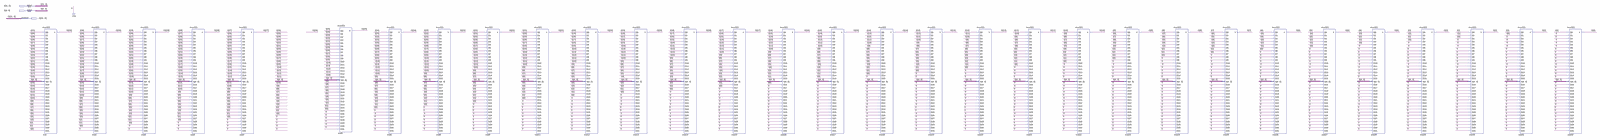
[diagram p0: schematic sheet, whole]
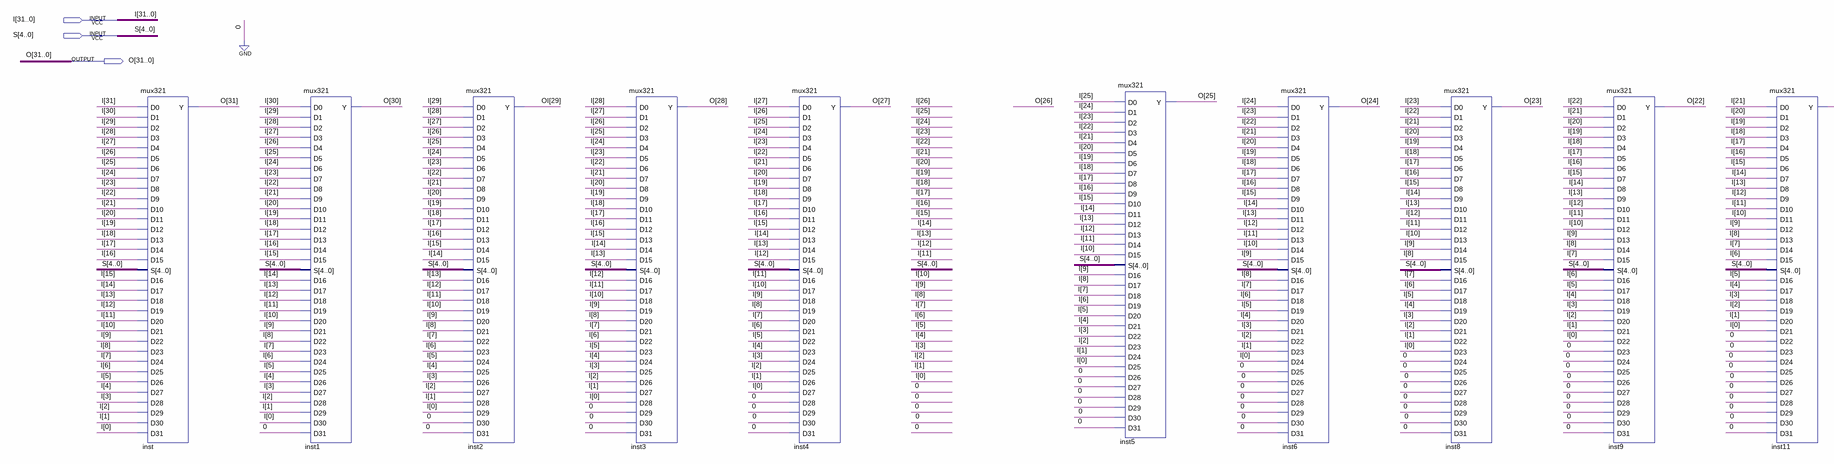
[diagram p1: schematic sheet, left part]
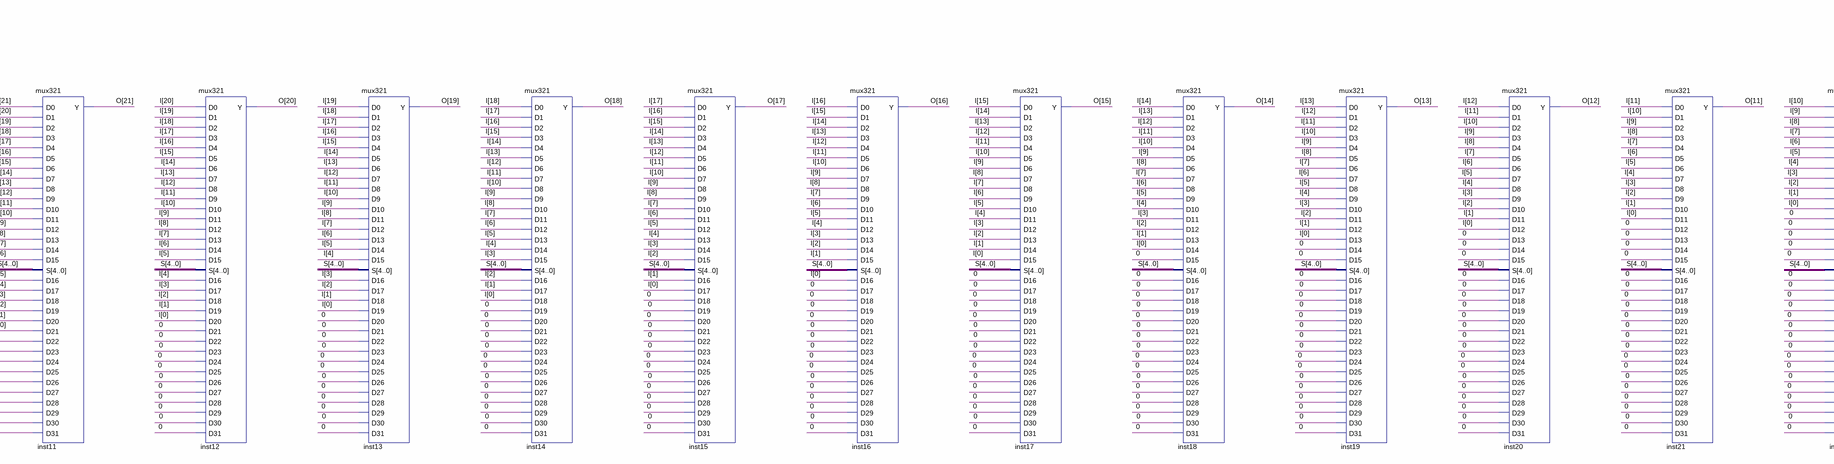
[diagram p2: schematic sheet, centre part]
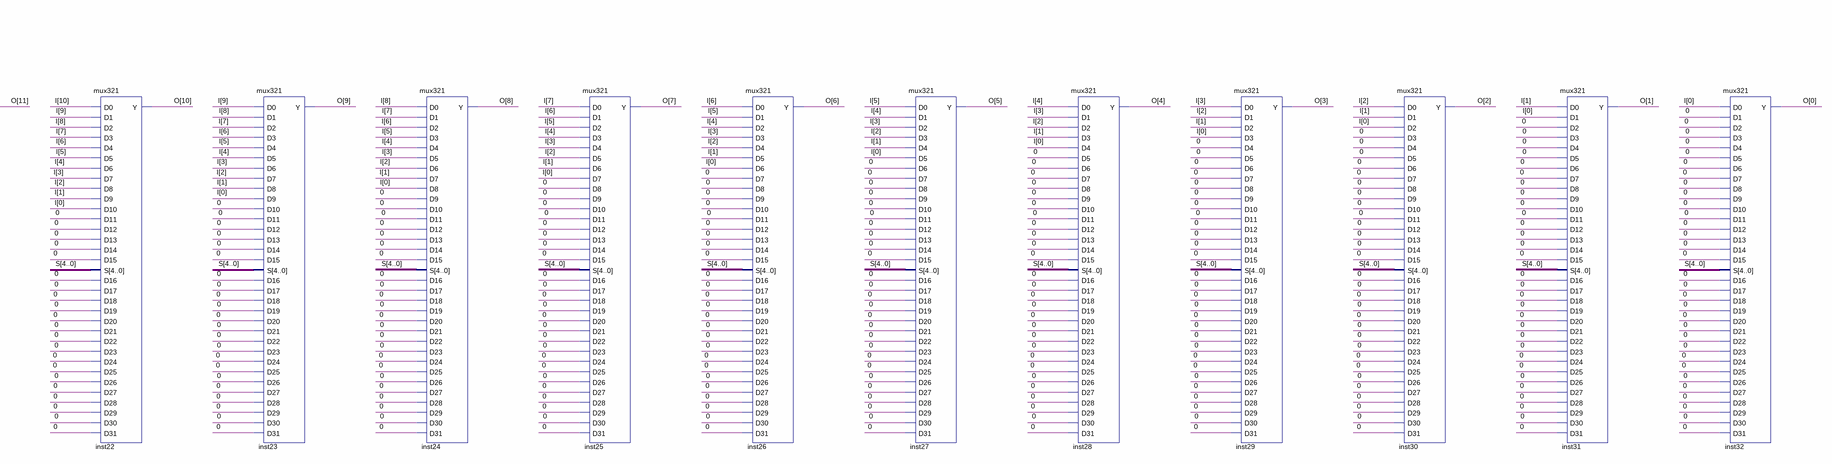
[diagram p3: schematic sheet, right part]
// Quartus schematic Shift_Left_32b.bdf as structural Verilog: 31 symbols, 3 pins
module Shift_Left_32b (
  input  [31:0] I,
  input  [4:0] S,
  output [31:0] O
);

  wire [29:29] OI;

  mux321 inst (
    .D0(I[31]), .D1(I[30]), .D2(I[29]), .D3(I[28]), .D4(I[27]), .D5(I[26]), .D6(I[25]), .D7(I[24]),
    .D8(I[23]), .D9(I[22]), .D10(I[21]), .D11(I[20]), .D12(I[19]), .D13(I[18]), .D14(I[17]), .D15(I[16]),
    .S(S), .D16(I[15]), .D17(I[14]), .D18(I[13]), .D19(I[12]), .D20(I[11]), .D21(I[10]), .D22(I[9]),
    .D23(I[8]), .D24(I[7]), .D25(I[6]), .D26(I[5]), .D27(I[4]), .D28(I[3]), .D29(I[2]), .D30(I[1]),
    .D31(I[0]), .Y(O[31]));
  mux321 inst1 (
    .D0(I[30]), .D1(I[29]), .D2(I[28]), .D3(I[27]), .D4(I[26]), .D5(I[25]), .D6(I[24]), .D7(I[23]),
    .D8(I[22]), .D9(I[21]), .D10(I[20]), .D11(I[19]), .D12(I[18]), .D13(I[17]), .D14(I[16]), .D15(I[15]),
    .S(S), .D16(I[14]), .D17(I[13]), .D18(I[12]), .D19(I[11]), .D20(I[10]), .D21(I[9]), .D22(I[8]),
    .D23(I[7]), .D24(I[6]), .D25(I[5]), .D26(I[4]), .D27(I[3]), .D28(I[2]), .D29(I[1]), .D30(I[0]),
    .D31(1'b0), .Y(O[30]));
  mux321 inst2 (
    .D0(I[29]), .D1(I[28]), .D2(I[27]), .D3(I[26]), .D4(I[25]), .D5(I[24]), .D6(I[23]), .D7(I[22]),
    .D8(I[21]), .D9(I[20]), .D10(I[19]), .D11(I[18]), .D12(I[17]), .D13(I[16]), .D14(I[15]), .D15(I[14]),
    .S(S), .D16(I[13]), .D17(I[12]), .D18(I[11]), .D19(I[10]), .D20(I[9]), .D21(I[8]), .D22(I[7]),
    .D23(I[6]), .D24(I[5]), .D25(I[4]), .D26(I[3]), .D27(I[2]), .D28(I[1]), .D29(I[0]), .D30(1'b0),
    .D31(1'b0), .Y(OI[29]));
  mux321 inst3 (
    .D0(I[28]), .D1(I[27]), .D2(I[26]), .D3(I[25]), .D4(I[24]), .D5(I[23]), .D6(I[22]), .D7(I[21]),
    .D8(I[20]), .D9(I[19]), .D10(I[18]), .D11(I[17]), .D12(I[16]), .D13(I[15]), .D14(I[14]), .D15(I[13]),
    .S(S), .D16(I[12]), .D17(I[11]), .D18(I[10]), .D19(I[9]), .D20(I[8]), .D21(I[7]), .D22(I[6]), .D23(I[5]),
    .D24(I[4]), .D25(I[3]), .D26(I[2]), .D27(I[1]), .D28(I[0]), .D29(1'b0), .D30(1'b0), .D31(1'b0), .Y(O[28]));
  mux321 inst4 (
    .D0(I[27]), .D1(I[26]), .D2(I[25]), .D3(I[24]), .D4(I[23]), .D5(I[22]), .D6(I[21]), .D7(I[20]),
    .D8(I[19]), .D9(I[18]), .D10(I[17]), .D11(I[16]), .D12(I[15]), .D13(I[14]), .D14(I[13]), .D15(I[12]),
    .S(S), .D16(I[11]), .D17(I[10]), .D18(I[9]), .D19(I[8]), .D20(I[7]), .D21(I[6]), .D22(I[5]), .D23(I[4]),
    .D24(I[3]), .D25(I[2]), .D26(I[1]), .D27(I[0]), .D28(1'b0), .D29(1'b0), .D30(1'b0), .D31(1'b0), .Y(O[27]));
  mux321 inst5 (
    .D0(I[25]), .D1(I[24]), .D2(I[23]), .D3(I[22]), .D4(I[21]), .D5(I[20]), .D6(I[19]), .D7(I[18]),
    .D8(I[17]), .D9(I[16]), .D10(I[15]), .D11(I[14]), .D12(I[13]), .D13(I[12]), .D14(I[11]), .D15(I[10]),
    .S(S), .D16(I[9]), .D17(I[8]), .D18(I[7]), .D19(I[6]), .D20(I[5]), .D21(I[4]), .D22(I[3]), .D23(I[2]),
    .D24(I[1]), .D25(I[0]), .D26(1'b0), .D27(1'b0), .D28(1'b0), .D29(1'b0), .D30(1'b0), .D31(1'b0), .Y(O[25]));
  mux321 inst6 (
    .D0(I[24]), .D1(I[23]), .D2(I[22]), .D3(I[21]), .D4(I[20]), .D5(I[19]), .D6(I[18]), .D7(I[17]),
    .D8(I[16]), .D9(I[15]), .D10(I[14]), .D11(I[13]), .D12(I[12]), .D13(I[11]), .D14(I[10]), .D15(I[9]),
    .S(S), .D16(I[8]), .D17(I[7]), .D18(I[6]), .D19(I[5]), .D20(I[4]), .D21(I[3]), .D22(I[2]), .D23(I[1]),
    .D24(I[0]), .D25(1'b0), .D26(1'b0), .D27(1'b0), .D28(1'b0), .D29(1'b0), .D30(1'b0), .D31(1'b0), .Y(O[24]));
  mux321 inst8 (
    .D0(I[23]), .D1(I[22]), .D2(I[21]), .D3(I[20]), .D4(I[19]), .D5(I[18]), .D6(I[17]), .D7(I[16]),
    .D8(I[15]), .D9(I[14]), .D10(I[13]), .D11(I[12]), .D12(I[11]), .D13(I[10]), .D14(I[9]), .D15(I[8]),
    .S(S), .D16(I[7]), .D17(I[6]), .D18(I[5]), .D19(I[4]), .D20(I[3]), .D21(I[2]), .D22(I[1]), .D23(I[0]),
    .D24(1'b0), .D25(1'b0), .D26(1'b0), .D27(1'b0), .D28(1'b0), .D29(1'b0), .D30(1'b0), .D31(1'b0), .Y(O[23]));
  mux321 inst9 (
    .D0(I[22]), .D1(I[21]), .D2(I[20]), .D3(I[19]), .D4(I[18]), .D5(I[17]), .D6(I[16]), .D7(I[15]),
    .D8(I[14]), .D9(I[13]), .D10(I[12]), .D11(I[11]), .D12(I[10]), .D13(I[9]), .D14(I[8]), .D15(I[7]), .S(S),
    .D16(I[6]), .D17(I[5]), .D18(I[4]), .D19(I[3]), .D20(I[2]), .D21(I[1]), .D22(I[0]), .D23(1'b0),
    .D24(1'b0), .D25(1'b0), .D26(1'b0), .D27(1'b0), .D28(1'b0), .D29(1'b0), .D30(1'b0), .D31(1'b0), .Y(O[22]));
  mux321 inst11 (
    .D0(I[21]), .D1(I[20]), .D2(I[19]), .D3(I[18]), .D4(I[17]), .D5(I[16]), .D6(I[15]), .D7(I[14]),
    .D8(I[13]), .D9(I[12]), .D10(I[11]), .D11(I[10]), .D12(I[9]), .D13(I[8]), .D14(I[7]), .D15(I[6]), .S(S),
    .D16(I[5]), .D17(I[4]), .D18(I[3]), .D19(I[2]), .D20(I[1]), .D21(I[0]), .D22(1'b0), .D23(1'b0),
    .D24(1'b0), .D25(1'b0), .D26(1'b0), .D27(1'b0), .D28(1'b0), .D29(1'b0), .D30(1'b0), .D31(1'b0), .Y(O[21]));
  mux321 inst12 (
    .D0(I[20]), .D1(I[19]), .D2(I[18]), .D3(I[17]), .D4(I[16]), .D5(I[15]), .D6(I[14]), .D7(I[13]),
    .D8(I[12]), .D9(I[11]), .D10(I[10]), .D11(I[9]), .D12(I[8]), .D13(I[7]), .D14(I[6]), .D15(I[5]), .S(S),
    .D16(I[4]), .D17(I[3]), .D18(I[2]), .D19(I[1]), .D20(I[0]), .D21(1'b0), .D22(1'b0), .D23(1'b0),
    .D24(1'b0), .D25(1'b0), .D26(1'b0), .D27(1'b0), .D28(1'b0), .D29(1'b0), .D30(1'b0), .D31(1'b0), .Y(O[20]));
  mux321 inst13 (
    .D0(I[19]), .D1(I[18]), .D2(I[17]), .D3(I[16]), .D4(I[15]), .D5(I[14]), .D6(I[13]), .D7(I[12]),
    .D8(I[11]), .D9(I[10]), .D10(I[9]), .D11(I[8]), .D12(I[7]), .D13(I[6]), .D14(I[5]), .D15(I[4]), .S(S),
    .D16(I[3]), .D17(I[2]), .D18(I[1]), .D19(I[0]), .D20(1'b0), .D21(1'b0), .D22(1'b0), .D23(1'b0),
    .D24(1'b0), .D25(1'b0), .D26(1'b0), .D27(1'b0), .D28(1'b0), .D29(1'b0), .D30(1'b0), .D31(1'b0), .Y(O[19]));
  mux321 inst14 (
    .D0(I[18]), .D1(I[17]), .D2(I[16]), .D3(I[15]), .D4(I[14]), .D5(I[13]), .D6(I[12]), .D7(I[11]),
    .D8(I[10]), .D9(I[9]), .D10(I[8]), .D11(I[7]), .D12(I[6]), .D13(I[5]), .D14(I[4]), .D15(I[3]), .S(S),
    .D16(I[2]), .D17(I[1]), .D18(I[0]), .D19(1'b0), .D20(1'b0), .D21(1'b0), .D22(1'b0), .D23(1'b0),
    .D24(1'b0), .D25(1'b0), .D26(1'b0), .D27(1'b0), .D28(1'b0), .D29(1'b0), .D30(1'b0), .D31(1'b0), .Y(O[18]));
  mux321 inst15 (
    .D0(I[17]), .D1(I[16]), .D2(I[15]), .D3(I[14]), .D4(I[13]), .D5(I[12]), .D6(I[11]), .D7(I[10]),
    .D8(I[9]), .D9(I[8]), .D10(I[7]), .D11(I[6]), .D12(I[5]), .D13(I[4]), .D14(I[3]), .D15(I[2]), .S(S),
    .D16(I[1]), .D17(I[0]), .D18(1'b0), .D19(1'b0), .D20(1'b0), .D21(1'b0), .D22(1'b0), .D23(1'b0),
    .D24(1'b0), .D25(1'b0), .D26(1'b0), .D27(1'b0), .D28(1'b0), .D29(1'b0), .D30(1'b0), .D31(1'b0), .Y(O[17]));
  mux321 inst16 (
    .D0(I[16]), .D1(I[15]), .D2(I[14]), .D3(I[13]), .D4(I[12]), .D5(I[11]), .D6(I[10]), .D7(I[9]), .D8(I[8]),
    .D9(I[7]), .D10(I[6]), .D11(I[5]), .D12(I[4]), .D13(I[3]), .D14(I[2]), .D15(I[1]), .S(S), .D16(I[0]),
    .D17(1'b0), .D18(1'b0), .D19(1'b0), .D20(1'b0), .D21(1'b0), .D22(1'b0), .D23(1'b0), .D24(1'b0),
    .D25(1'b0), .D26(1'b0), .D27(1'b0), .D28(1'b0), .D29(1'b0), .D30(1'b0), .D31(1'b0), .Y(O[16]));
  mux321 inst17 (
    .D0(I[15]), .D1(I[14]), .D2(I[13]), .D3(I[12]), .D4(I[11]), .D5(I[10]), .D6(I[9]), .D7(I[8]), .D8(I[7]),
    .D9(I[6]), .D10(I[5]), .D11(I[4]), .D12(I[3]), .D13(I[2]), .D14(I[1]), .D15(I[0]), .S(S), .D16(1'b0),
    .D17(1'b0), .D18(1'b0), .D19(1'b0), .D20(1'b0), .D21(1'b0), .D22(1'b0), .D23(1'b0), .D24(1'b0),
    .D25(1'b0), .D26(1'b0), .D27(1'b0), .D28(1'b0), .D29(1'b0), .D30(1'b0), .D31(1'b0), .Y(O[15]));
  mux321 inst18 (
    .D0(I[14]), .D1(I[13]), .D2(I[12]), .D3(I[11]), .D4(I[10]), .D5(I[9]), .D6(I[8]), .D7(I[7]), .D8(I[6]),
    .D9(I[5]), .D10(I[4]), .D11(I[3]), .D12(I[2]), .D13(I[1]), .D14(I[0]), .D15(1'b0), .S(S), .D16(1'b0),
    .D17(1'b0), .D18(1'b0), .D19(1'b0), .D20(1'b0), .D21(1'b0), .D22(1'b0), .D23(1'b0), .D24(1'b0),
    .D25(1'b0), .D26(1'b0), .D27(1'b0), .D28(1'b0), .D29(1'b0), .D30(1'b0), .D31(1'b0), .Y(O[14]));
  mux321 inst19 (
    .D0(I[13]), .D1(I[12]), .D2(I[11]), .D3(I[10]), .D4(I[9]), .D5(I[8]), .D6(I[7]), .D7(I[6]), .D8(I[5]),
    .D9(I[4]), .D10(I[3]), .D11(I[2]), .D12(I[1]), .D13(I[0]), .D14(1'b0), .D15(1'b0), .S(S), .D16(1'b0),
    .D17(1'b0), .D18(1'b0), .D19(1'b0), .D20(1'b0), .D21(1'b0), .D22(1'b0), .D23(1'b0), .D24(1'b0),
    .D25(1'b0), .D26(1'b0), .D27(1'b0), .D28(1'b0), .D29(1'b0), .D30(1'b0), .D31(1'b0), .Y(O[13]));
  mux321 inst20 (
    .D0(I[12]), .D1(I[11]), .D2(I[10]), .D3(I[9]), .D4(I[8]), .D5(I[7]), .D6(I[6]), .D7(I[5]), .D8(I[4]),
    .D9(I[3]), .D10(I[2]), .D11(I[1]), .D12(I[0]), .D13(1'b0), .D14(1'b0), .D15(1'b0), .S(S), .D16(1'b0),
    .D17(1'b0), .D18(1'b0), .D19(1'b0), .D20(1'b0), .D21(1'b0), .D22(1'b0), .D23(1'b0), .D24(1'b0),
    .D25(1'b0), .D26(1'b0), .D27(1'b0), .D28(1'b0), .D29(1'b0), .D30(1'b0), .D31(1'b0), .Y(O[12]));
  mux321 inst21 (
    .D0(I[11]), .D1(I[10]), .D2(I[9]), .D3(I[8]), .D4(I[7]), .D5(I[6]), .D6(I[5]), .D7(I[4]), .D8(I[3]),
    .D9(I[2]), .D10(I[1]), .D11(I[0]), .D12(1'b0), .D13(1'b0), .D14(1'b0), .D15(1'b0), .S(S), .D16(1'b0),
    .D17(1'b0), .D18(1'b0), .D19(1'b0), .D20(1'b0), .D21(1'b0), .D22(1'b0), .D23(1'b0), .D24(1'b0),
    .D25(1'b0), .D26(1'b0), .D27(1'b0), .D28(1'b0), .D29(1'b0), .D30(1'b0), .D31(1'b0), .Y(O[11]));
  mux321 inst22 (
    .D0(I[10]), .D1(I[9]), .D2(I[8]), .D3(I[7]), .D4(I[6]), .D5(I[5]), .D6(I[4]), .D7(I[3]), .D8(I[2]),
    .D9(I[1]), .D10(I[0]), .D11(1'b0), .D12(1'b0), .D13(1'b0), .D14(1'b0), .D15(1'b0), .S(S), .D16(1'b0),
    .D17(1'b0), .D18(1'b0), .D19(1'b0), .D20(1'b0), .D21(1'b0), .D22(1'b0), .D23(1'b0), .D24(1'b0),
    .D25(1'b0), .D26(1'b0), .D27(1'b0), .D28(1'b0), .D29(1'b0), .D30(1'b0), .D31(1'b0), .Y(O[10]));
  mux321 inst23 (
    .D0(I[9]), .D1(I[8]), .D2(I[7]), .D3(I[6]), .D4(I[5]), .D5(I[4]), .D6(I[3]), .D7(I[2]), .D8(I[1]),
    .D9(I[0]), .D10(1'b0), .D11(1'b0), .D12(1'b0), .D13(1'b0), .D14(1'b0), .D15(1'b0), .S(S), .D16(1'b0),
    .D17(1'b0), .D18(1'b0), .D19(1'b0), .D20(1'b0), .D21(1'b0), .D22(1'b0), .D23(1'b0), .D24(1'b0),
    .D25(1'b0), .D26(1'b0), .D27(1'b0), .D28(1'b0), .D29(1'b0), .D30(1'b0), .D31(1'b0), .Y(O[9]));
  mux321 inst24 (
    .D0(I[8]), .D1(I[7]), .D2(I[6]), .D3(I[5]), .D4(I[4]), .D5(I[3]), .D6(I[2]), .D7(I[1]), .D8(I[0]),
    .D9(1'b0), .D10(1'b0), .D11(1'b0), .D12(1'b0), .D13(1'b0), .D14(1'b0), .D15(1'b0), .S(S), .D16(1'b0),
    .D17(1'b0), .D18(1'b0), .D19(1'b0), .D20(1'b0), .D21(1'b0), .D22(1'b0), .D23(1'b0), .D24(1'b0),
    .D25(1'b0), .D26(1'b0), .D27(1'b0), .D28(1'b0), .D29(1'b0), .D30(1'b0), .D31(1'b0), .Y(O[8]));
  mux321 inst25 (
    .D0(I[7]), .D1(I[6]), .D2(I[5]), .D3(I[4]), .D4(I[3]), .D5(I[2]), .D6(I[1]), .D7(I[0]), .D8(1'b0),
    .D9(1'b0), .D10(1'b0), .D11(1'b0), .D12(1'b0), .D13(1'b0), .D14(1'b0), .D15(1'b0), .S(S), .D16(1'b0),
    .D17(1'b0), .D18(1'b0), .D19(1'b0), .D20(1'b0), .D21(1'b0), .D22(1'b0), .D23(1'b0), .D24(1'b0),
    .D25(1'b0), .D26(1'b0), .D27(1'b0), .D28(1'b0), .D29(1'b0), .D30(1'b0), .D31(1'b0), .Y(O[7]));
  mux321 inst26 (
    .D0(I[6]), .D1(I[5]), .D2(I[4]), .D3(I[3]), .D4(I[2]), .D5(I[1]), .D6(I[0]), .D7(1'b0), .D8(1'b0),
    .D9(1'b0), .D10(1'b0), .D11(1'b0), .D12(1'b0), .D13(1'b0), .D14(1'b0), .D15(1'b0), .S(S), .D16(1'b0),
    .D17(1'b0), .D18(1'b0), .D19(1'b0), .D20(1'b0), .D21(1'b0), .D22(1'b0), .D23(1'b0), .D24(1'b0),
    .D25(1'b0), .D26(1'b0), .D27(1'b0), .D28(1'b0), .D29(1'b0), .D30(1'b0), .D31(1'b0), .Y(O[6]));
  mux321 inst27 (
    .D0(I[5]), .D1(I[4]), .D2(I[3]), .D3(I[2]), .D4(I[1]), .D5(I[0]), .D6(1'b0), .D7(1'b0), .D8(1'b0),
    .D9(1'b0), .D10(1'b0), .D11(1'b0), .D12(1'b0), .D13(1'b0), .D14(1'b0), .D15(1'b0), .S(S), .D16(1'b0),
    .D17(1'b0), .D18(1'b0), .D19(1'b0), .D20(1'b0), .D21(1'b0), .D22(1'b0), .D23(1'b0), .D24(1'b0),
    .D25(1'b0), .D26(1'b0), .D27(1'b0), .D28(1'b0), .D29(1'b0), .D30(1'b0), .D31(1'b0), .Y(O[5]));
  mux321 inst28 (
    .D0(I[4]), .D1(I[3]), .D2(I[2]), .D3(I[1]), .D4(I[0]), .D5(1'b0), .D6(1'b0), .D7(1'b0), .D8(1'b0),
    .D9(1'b0), .D10(1'b0), .D11(1'b0), .D12(1'b0), .D13(1'b0), .D14(1'b0), .D15(1'b0), .S(S), .D16(1'b0),
    .D17(1'b0), .D18(1'b0), .D19(1'b0), .D20(1'b0), .D21(1'b0), .D22(1'b0), .D23(1'b0), .D24(1'b0),
    .D25(1'b0), .D26(1'b0), .D27(1'b0), .D28(1'b0), .D29(1'b0), .D30(1'b0), .D31(1'b0), .Y(O[4]));
  mux321 inst29 (
    .D0(I[3]), .D1(I[2]), .D2(I[1]), .D3(I[0]), .D4(1'b0), .D5(1'b0), .D6(1'b0), .D7(1'b0), .D8(1'b0),
    .D9(1'b0), .D10(1'b0), .D11(1'b0), .D12(1'b0), .D13(1'b0), .D14(1'b0), .D15(1'b0), .S(S), .D16(1'b0),
    .D17(1'b0), .D18(1'b0), .D19(1'b0), .D20(1'b0), .D21(1'b0), .D22(1'b0), .D23(1'b0), .D24(1'b0),
    .D25(1'b0), .D26(1'b0), .D27(1'b0), .D28(1'b0), .D29(1'b0), .D30(1'b0), .D31(1'b0), .Y(O[3]));
  mux321 inst30 (
    .D0(I[2]), .D1(I[1]), .D2(I[0]), .D3(1'b0), .D4(1'b0), .D5(1'b0), .D6(1'b0), .D7(1'b0), .D8(1'b0),
    .D9(1'b0), .D10(1'b0), .D11(1'b0), .D12(1'b0), .D13(1'b0), .D14(1'b0), .D15(1'b0), .S(S), .D16(1'b0),
    .D17(1'b0), .D18(1'b0), .D19(1'b0), .D20(1'b0), .D21(1'b0), .D22(1'b0), .D23(1'b0), .D24(1'b0),
    .D25(1'b0), .D26(1'b0), .D27(1'b0), .D28(1'b0), .D29(1'b0), .D30(1'b0), .D31(1'b0), .Y(O[2]));
  mux321 inst31 (
    .D0(I[1]), .D1(I[0]), .D2(1'b0), .D3(1'b0), .D4(1'b0), .D5(1'b0), .D6(1'b0), .D7(1'b0), .D8(1'b0),
    .D9(1'b0), .D10(1'b0), .D11(1'b0), .D12(1'b0), .D13(1'b0), .D14(1'b0), .D15(1'b0), .S(S), .D16(1'b0),
    .D17(1'b0), .D18(1'b0), .D19(1'b0), .D20(1'b0), .D21(1'b0), .D22(1'b0), .D23(1'b0), .D24(1'b0),
    .D25(1'b0), .D26(1'b0), .D27(1'b0), .D28(1'b0), .D29(1'b0), .D30(1'b0), .D31(1'b0), .Y(O[1]));
  mux321 inst32 (
    .D0(I[0]), .D1(1'b0), .D2(1'b0), .D3(1'b0), .D4(1'b0), .D5(1'b0), .D6(1'b0), .D7(1'b0), .D8(1'b0),
    .D9(1'b0), .D10(1'b0), .D11(1'b0), .D12(1'b0), .D13(1'b0), .D14(1'b0), .D15(1'b0), .S(S), .D16(1'b0),
    .D17(1'b0), .D18(1'b0), .D19(1'b0), .D20(1'b0), .D21(1'b0), .D22(1'b0), .D23(1'b0), .D24(1'b0),
    .D25(1'b0), .D26(1'b0), .D27(1'b0), .D28(1'b0), .D29(1'b0), .D30(1'b0), .D31(1'b0), .Y(O[0]));
endmodule
